# Altium schematic sheet Nest-Ditrib.SchDoc
size A3; SheetNumber: 1; SheetTotal: 1
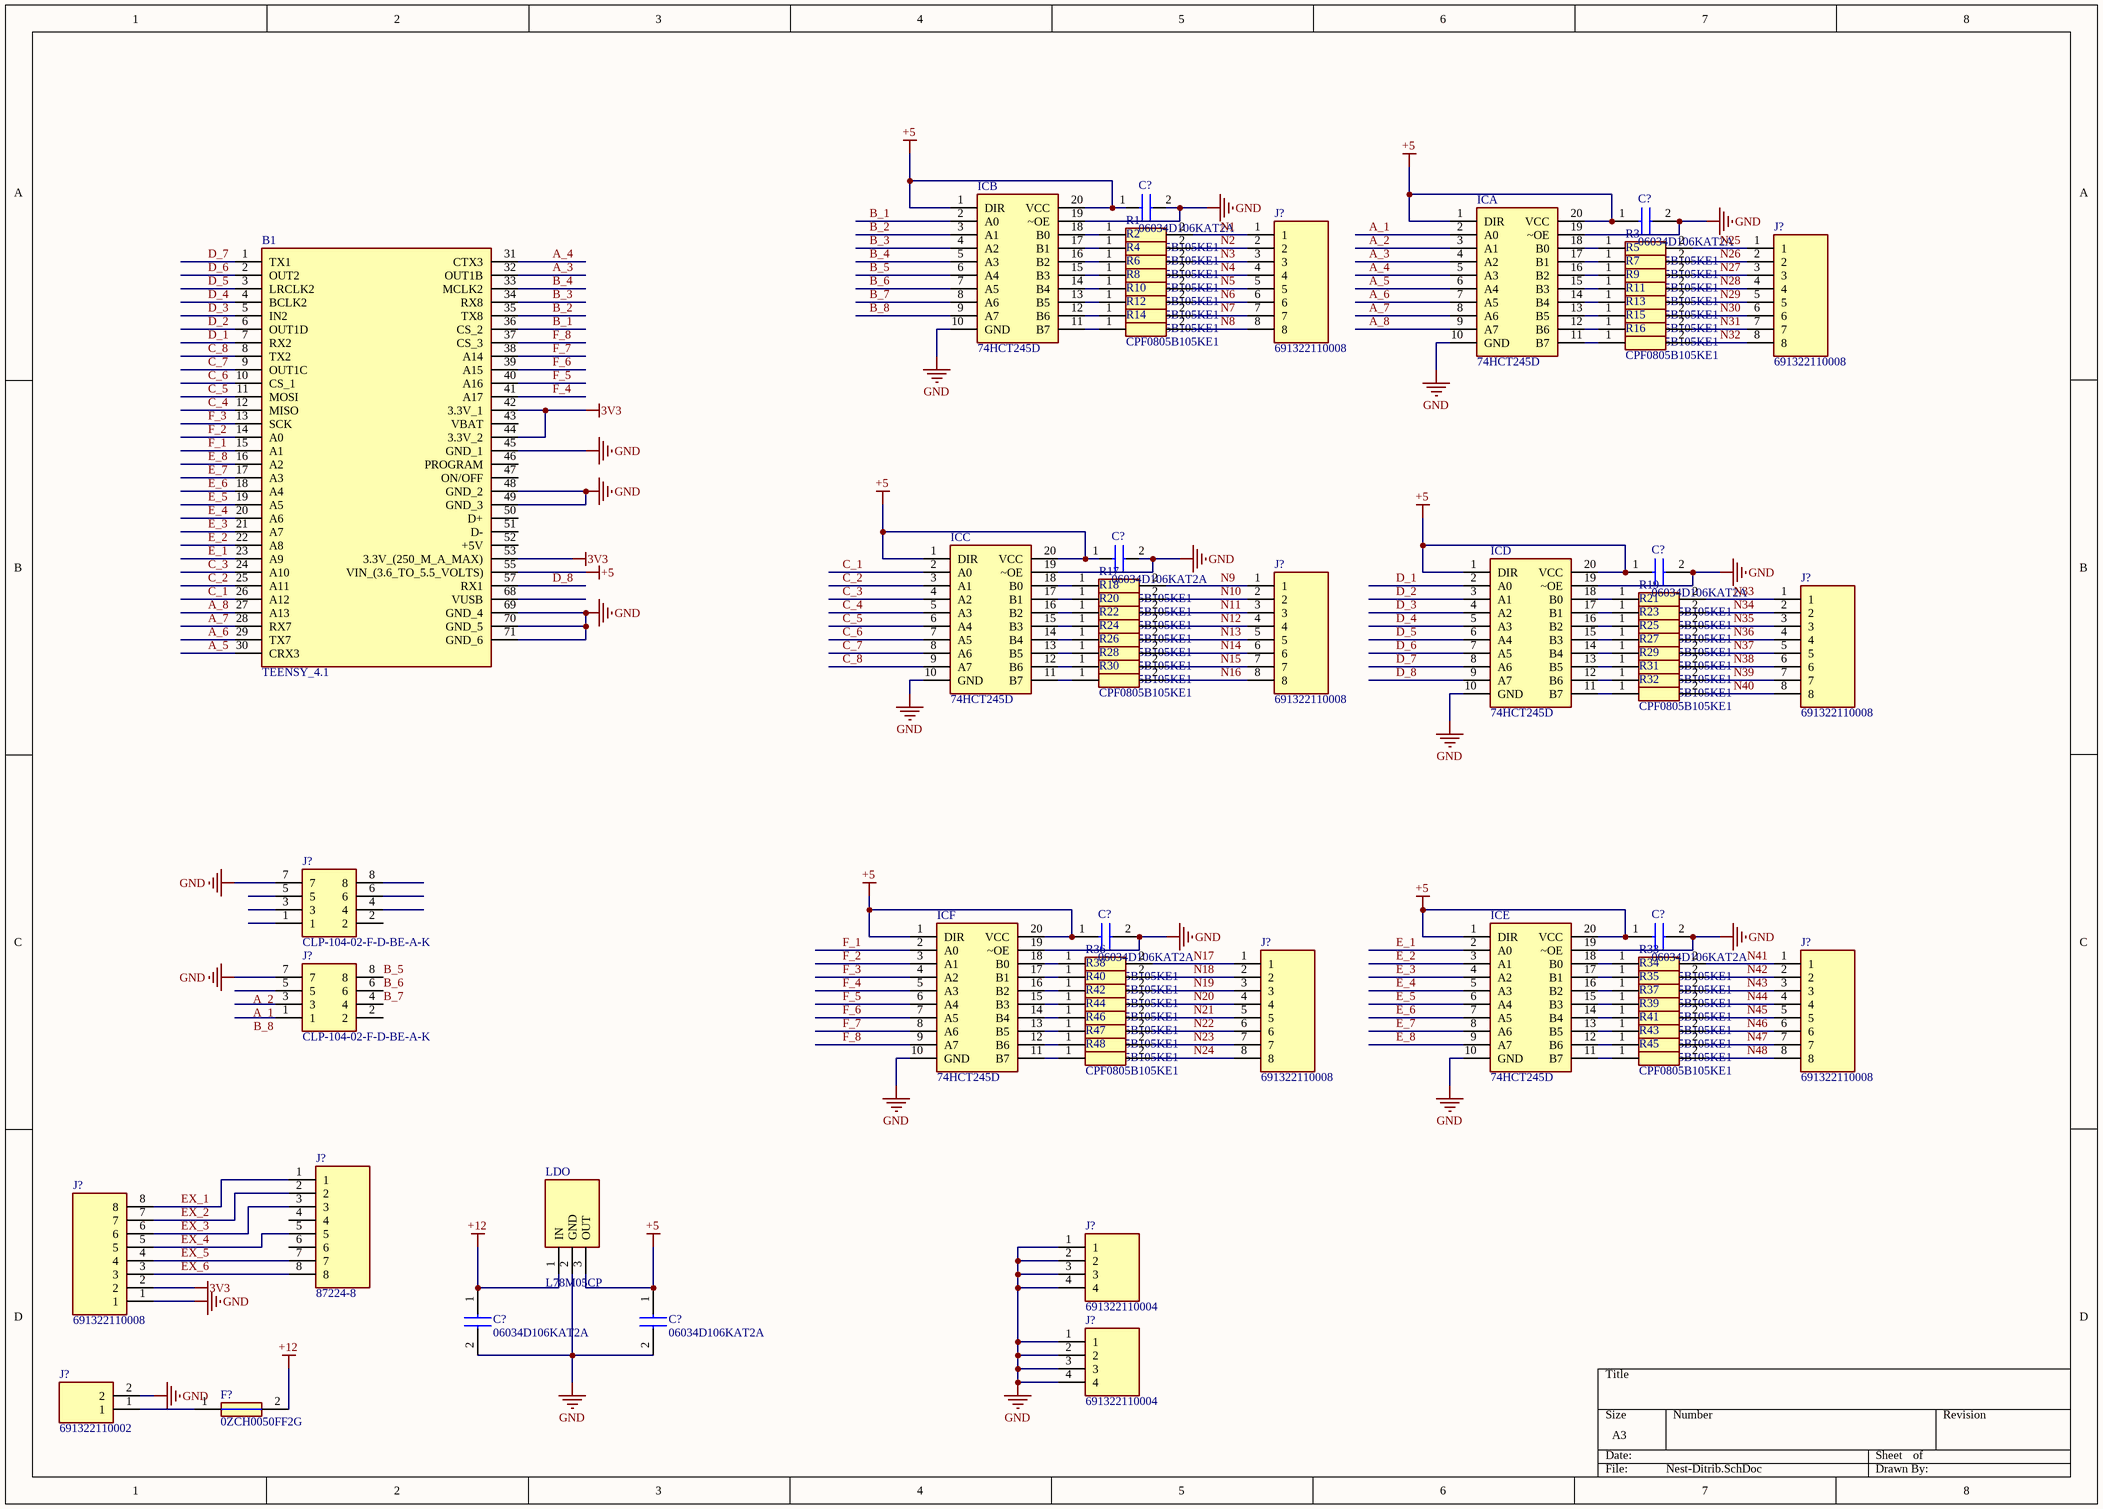
[diagram p0: Nest-Ditrib.SchDoc]

## Parts
(Parts that share a designator on the sheet are numbered #1, #2 ... from top to bottom, then left to right.)
B1  TEENSY_4.1  [TEENSY41]
C?#1  06034D106KAT2A  [CAPC1608X90N]
C?#2  06034D106KAT2A  [CAPC1608X90N]
C?#3  06034D106KAT2A  [CAPC1608X90N]
C?#4  06034D106KAT2A  [CAPC1608X90N]
C?#5  06034D106KAT2A  [CAPC1608X90N]
C?#6  06034D106KAT2A  [CAPC1608X90N]
C?#7  06034D106KAT2A  [CAPC1608X90N]
C?#8  06034D106KAT2A  [CAPC1608X90N]
F?  0ZCH0050FF2G  [FUSC3226X75N]
ICA  74HCT245D  [SOIC127P1032X265-20N]
ICB  74HCT245D  [SOIC127P1032X265-20N]
ICC  74HCT245D  [SOIC127P1032X265-20N]
ICD  74HCT245D  [SOIC127P1032X265-20N]
ICE  74HCT245D  [SOIC127P1032X265-20N]
ICF  74HCT245D  [SOIC127P1032X265-20N]
J?#1  691322110008  [SHDRRA8W80P0X350_1X8_2940X920X720P]
J?#2  691322110008  [SHDRRA8W80P0X350_1X8_2940X920X720P]
J?#3  691322110008  [SHDRRA8W80P0X350_1X8_2940X920X720P]
J?#4  691322110008  [SHDRRA8W80P0X350_1X8_2940X920X720P]
J?#5  CLP-104-02-F-D-BE-A-K  [CLP-104-02-XXX-D-BE-A-K]
J?#6  691322110008  [SHDRRA8W80P0X350_1X8_2940X920X720P]
J?#7  691322110008  [SHDRRA8W80P0X350_1X8_2940X920X720P]
J?#8  CLP-104-02-F-D-BE-A-K  [CLP-104-02-XXX-D-BE-A-K]
J?#9  87224-8  [HDRV8W77P0X254_1X8_1991X254X1037P]
J?#10  691322110004  [SHDRRA4W80P0X350_1X4_1540X920X700P]
J?#11  691322110008  [SHDRRA8W80P0X350_1X8_2940X920X720P]
J?#12  691322110004  [SHDRRA4W80P0X350_1X4_1540X920X700P]
J?#13  691322110002  [SHDRRA2W80P0X350_1X2_840X920X720P]
LDO  L78M05CP  [TO255P460X1020X2030-3P]
R1  CPF0805B105KE1  [RESC2012X65N]
R2  CPF0805B105KE1  [RESC2012X65N]
R3  CPF0805B105KE1  [RESC2012X65N]
R4  CPF0805B105KE1  [RESC2012X65N]
R5  CPF0805B105KE1  [RESC2012X65N]
R6  CPF0805B105KE1  [RESC2012X65N]
R7  CPF0805B105KE1  [RESC2012X65N]
R8  CPF0805B105KE1  [RESC2012X65N]
R9  CPF0805B105KE1  [RESC2012X65N]
R10  CPF0805B105KE1  [RESC2012X65N]
R11  CPF0805B105KE1  [RESC2012X65N]
R12  CPF0805B105KE1  [RESC2012X65N]
R13  CPF0805B105KE1  [RESC2012X65N]
R14  CPF0805B105KE1  [RESC2012X65N]
R15  CPF0805B105KE1  [RESC2012X65N]
R16  CPF0805B105KE1  [RESC2012X65N]
R17  CPF0805B105KE1  [RESC2012X65N]
R18  CPF0805B105KE1  [RESC2012X65N]
R19  CPF0805B105KE1  [RESC2012X65N]
R20  CPF0805B105KE1  [RESC2012X65N]
R21  CPF0805B105KE1  [RESC2012X65N]
R22  CPF0805B105KE1  [RESC2012X65N]
R23  CPF0805B105KE1  [RESC2012X65N]
R24  CPF0805B105KE1  [RESC2012X65N]
R25  CPF0805B105KE1  [RESC2012X65N]
R26  CPF0805B105KE1  [RESC2012X65N]
R27  CPF0805B105KE1  [RESC2012X65N]
R28  CPF0805B105KE1  [RESC2012X65N]
R29  CPF0805B105KE1  [RESC2012X65N]
R30  CPF0805B105KE1  [RESC2012X65N]
R31  CPF0805B105KE1  [RESC2012X65N]
R32  CPF0805B105KE1  [RESC2012X65N]
R33  CPF0805B105KE1  [RESC2012X65N]
R34  CPF0805B105KE1  [RESC2012X65N]
R35  CPF0805B105KE1  [RESC2012X65N]
R36  CPF0805B105KE1  [RESC2012X65N]
R37  CPF0805B105KE1  [RESC2012X65N]
R38  CPF0805B105KE1  [RESC2012X65N]
R39  CPF0805B105KE1  [RESC2012X65N]
R40  CPF0805B105KE1  [RESC2012X65N]
R41  CPF0805B105KE1  [RESC2012X65N]
R42  CPF0805B105KE1  [RESC2012X65N]
R43  CPF0805B105KE1  [RESC2012X65N]
R44  CPF0805B105KE1  [RESC2012X65N]
R45  CPF0805B105KE1  [RESC2012X65N]
R46  CPF0805B105KE1  [RESC2012X65N]
R47  CPF0805B105KE1  [RESC2012X65N]
R48  CPF0805B105KE1  [RESC2012X65N]

## Nets
3V3: B1.42(3.3V_1) B1.44(3.3V_2) B1.53(3.3V_(250_M_A_MAX)) J?#11.2
+5: B1.55(VIN_(3.6_TO_5.5_VOLTS)) C?#1.1 C?#2.1 C?#3.1 C?#4.1 C?#5.1 C?#6.1 C?#8.1 ICA.1(DIR) ICA.20(VCC) ICB.1(DIR) ICB.20(VCC) ICC.1(DIR) ICC.20(VCC) ICD.1(DIR) ICD.20(VCC) ICE.1(DIR) ICE.20(VCC) ICF.1(DIR) ICF.20(VCC) LDO.3(OUT)
+12: C?#7.1 F?.2 LDO.1(IN)
GND: B1.45(GND_1) B1.48(GND_2) B1.49(GND_3) B1.69(GND_4) B1.70(GND_5) B1.71(GND_6) C?#1.2 C?#2.2 C?#3.2 C?#4.2 C?#5.2 C?#6.2 C?#7.2 C?#8.2 ICA.10(GND) ICA.19(~OE) ICB.10(GND) ICB.19(~OE) ICC.10(GND) ICC.19(~OE) ICD.10(GND) ICD.19(~OE) ICE.10(GND) ICE.19(~OE) ICF.10(GND) ICF.19(~OE) J?#5.7 J?#8.7 J?#10.1 J?#10.2 J?#10.3 J?#10.4 J?#11.1 J?#12.1 J?#12.2 J?#12.3 J?#12.4 J?#13.2 LDO.2(GND)
A_1: ICA.2(A0) J?#8.3
A_2: ICA.3(A1) J?#8.5
A_3: B1.32(OUT1B) ICA.4(A2)
A_4: B1.31(CTX3) ICA.5(A3)
A_5: B1.30(CRX3) ICA.6(A4)
A_6: B1.29(TX7) ICA.7(A5)
A_7: B1.28(RX7) ICA.8(A6)
A_8: B1.27(A13) ICA.9(A7)
B_1: B1.36(CS_2) ICB.2(A0)
B_2: B1.35(TX8) ICB.3(A1)
B_3: B1.34(RX8) ICB.4(A2)
B_4: B1.33(MCLK2) ICB.5(A3)
B_5: ICB.6(A4) J?#8.8
B_6: ICB.7(A5) J?#8.6
B_7: ICB.8(A6) J?#8.4
B_8: ICB.9(A7) J?#8.1
C_1: B1.26(A12) ICC.2(A0)
C_2: B1.25(A11) ICC.3(A1)
C_3: B1.24(A10) ICC.4(A2)
C_4: B1.12(MISO) ICC.5(A3)
C_5: B1.11(MOSI) ICC.6(A4)
C_6: B1.10(CS_1) ICC.7(A5)
C_7: B1.9(OUT1C) ICC.8(A6)
C_8: B1.8(TX2) ICC.9(A7)
D_1: B1.7(RX2) ICD.2(A0)
D_2: B1.6(OUT1D) ICD.3(A1)
D_3: B1.5(IN2) ICD.4(A2)
D_4: B1.4(BCLK2) ICD.5(A3)
D_5: B1.3(LRCLK2) ICD.6(A4)
D_6: B1.2(OUT2) ICD.7(A5)
D_7: B1.1(TX1) ICD.8(A6)
D_8: B1.57(RX1) ICD.9(A7)
E_1: B1.23(A9) ICE.2(A0)
E_2: B1.22(A8) ICE.3(A1)
E_3: B1.21(A7) ICE.4(A2)
E_4: B1.20(A6) ICE.5(A3)
E_5: B1.19(A5) ICE.6(A4)
E_6: B1.18(A4) ICE.7(A5)
E_7: B1.17(A3) ICE.8(A6)
E_8: B1.16(A2) ICE.9(A7)
EX_1: J?#9.1 J?#11.8
EX_2: J?#9.2 J?#11.7
EX_3: J?#9.3 J?#11.6
EX_4: J?#9.5 J?#11.5
EX_5: J?#9.7 J?#11.4
EX_6: J?#9.8 J?#11.3
F_1: B1.15(A1) ICF.2(A0)
F_2: B1.14(A0) ICF.3(A1)
F_3: B1.13(SCK) ICF.4(A2)
F_4: B1.41(A17) ICF.5(A3)
F_5: B1.40(A16) ICF.6(A4)
F_6: B1.39(A15) ICF.7(A5)
F_7: B1.38(A14) ICF.8(A6)
F_8: B1.37(CS_3) ICF.9(A7)
N1: J?#1.1 R1.2
N2: J?#1.2 R2.2
N3: J?#1.3 R4.2
N4: J?#1.4 R6.2
N5: J?#1.5 R8.2
N6: J?#1.6 R10.2
N7: J?#1.7 R12.2
N8: J?#1.8 R14.2
N9: J?#3.1 R17.2
N10: J?#3.2 R18.2
N11: J?#3.3 R20.2
N12: J?#3.4 R22.2
N13: J?#3.5 R24.2
N14: J?#3.6 R26.2
N15: J?#3.7 R28.2
N16: J?#3.8 R30.2
N17: J?#6.1 R36.2
N18: J?#6.2 R38.2
N19: J?#6.3 R40.2
N20: J?#6.4 R42.2
N21: J?#6.5 R44.2
N22: J?#6.6 R46.2
N23: J?#6.7 R47.2
N24: J?#6.8 R48.2
N25: J?#2.1 R3.2
N26: J?#2.2 R5.2
N27: J?#2.3 R7.2
N28: J?#2.4 R9.2
N29: J?#2.5 R11.2
N30: J?#2.6 R13.2
N31: J?#2.7 R15.2
N32: J?#2.8 R16.2
N33: J?#4.1 R19.2
N34: J?#4.2 R21.2
N35: J?#4.3 R23.2
N36: J?#4.4 R25.2
N37: J?#4.5 R27.2
N38: J?#4.6 R29.2
N39: J?#4.7 R31.2
N40: J?#4.8 R32.2
N41: J?#7.1 R33.2
N42: J?#7.2 R34.2
N43: J?#7.3 R35.2
N44: J?#7.4 R37.2
N45: J?#7.5 R39.2
N46: J?#7.6 R41.2
N47: J?#7.7 R43.2
N48: J?#7.8 R45.2
NetF?_1: F?.1 J?#13.1
NetICA_11: ICA.11(B7) R16.1
NetICA_12: ICA.12(B6) R15.1
NetICA_13: ICA.13(B5) R13.1
NetICA_14: ICA.14(B4) R11.1
NetICA_15: ICA.15(B3) R9.1
NetICA_16: ICA.16(B2) R7.1
NetICA_17: ICA.17(B1) R5.1
NetICA_18: ICA.18(B0) R3.1
NetICB_11: ICB.11(B7) R14.1
NetICB_12: ICB.12(B6) R12.1
NetICB_13: ICB.13(B5) R10.1
NetICB_14: ICB.14(B4) R8.1
NetICB_15: ICB.15(B3) R6.1
NetICB_16: ICB.16(B2) R4.1
NetICB_17: ICB.17(B1) R2.1
NetICB_18: ICB.18(B0) R1.1
NetICC_11: ICC.11(B7) R30.1
NetICC_12: ICC.12(B6) R28.1
NetICC_13: ICC.13(B5) R26.1
NetICC_14: ICC.14(B4) R24.1
NetICC_15: ICC.15(B3) R22.1
NetICC_16: ICC.16(B2) R20.1
NetICC_17: ICC.17(B1) R18.1
NetICC_18: ICC.18(B0) R17.1
NetICD_11: ICD.11(B7) R32.1
NetICD_12: ICD.12(B6) R31.1
NetICD_13: ICD.13(B5) R29.1
NetICD_14: ICD.14(B4) R27.1
NetICD_15: ICD.15(B3) R25.1
NetICD_16: ICD.16(B2) R23.1
NetICD_17: ICD.17(B1) R21.1
NetICD_18: ICD.18(B0) R19.1
NetICE_11: ICE.11(B7) R45.1
NetICE_12: ICE.12(B6) R43.1
NetICE_13: ICE.13(B5) R41.1
NetICE_14: ICE.14(B4) R39.1
NetICE_15: ICE.15(B3) R37.1
NetICE_16: ICE.16(B2) R35.1
NetICE_17: ICE.17(B1) R34.1
NetICE_18: ICE.18(B0) R33.1
NetICF_11: ICF.11(B7) R48.1
NetICF_12: ICF.12(B6) R47.1
NetICF_13: ICF.13(B5) R46.1
NetICF_14: ICF.14(B4) R44.1
NetICF_15: ICF.15(B3) R42.1
NetICF_16: ICF.16(B2) R40.1
NetICF_17: ICF.17(B1) R38.1
NetICF_18: ICF.18(B0) R36.1

Not connected (* = marked no-connect by the designer): B1 43(VBAT) 46(PROGRAM) 47(ON/OFF) 50(D+) 51(D-) 52(+5V) 68(VUSB); J?#5 1 2 3 4 5 6 8; J?#8 2; J?#9 4 6

## Library data of the parts
B1 = TEENSY_4.1: Teensy 4.1 Development Board; Manufacturer_Name: PJRC; Manufacturer_Part_Number: TEENSY 4.1; Mouser Part Number: *; Mouser Price/Stock: *; Arrow Part Number: *; Arrow Price/Stock: *; Datasheet Link: https://www.pjrc.com/store/teensy41.html
C?#1-C?#8 = 06034D106KAT2A: Capacitor; Manufacturer_Name: AVX; Datasheet Link: https://componentsearchengine.com/Datasheets/1/06031A100FAT2A.pdf; Height: 0.9mm; Manufacturer_Part_Number: 06034D106KAT2A; Mouser Part Number: 581-06034D106K; Mouser Price/Stock: https://www.mouser.co.uk/ProductDetail/AVX/06034D106KAT2A/?qs=yeMJfaiNeLxq%252BdDt9K4ETA%3D%3D; Arrow Part Number: 06034D106KAT2A; Arrow Price/Stock: https://www.arrow.com/en/products/06034d106kat2a/avx
F? = 0ZCH0050FF2G: Fuse; Manufacturer_Name: BelFuse; Datasheet Link: https://componentsearchengine.com/Datasheets/1/0ZCH0050FF2G.pdf; Height: 0.75mm; Manufacturer_Part_Number: 0ZCH0050FF2G; Mouser Part Number: 530-0ZCH0050FF2G; Mouser Price/Stock: https://www.mouser.co.uk/ProductDetail/Bel-Fuse/0ZCH0050FF2G?qs=SRYZG9HaIQ2VrAxOxbTdxQ%3D%3D; Arrow Part Number: 0ZCH0050FF2G; Arrow Price/Stock: https://www.arrow.com/en/products/0zch0050ff2g/bel-group
ICA ICB ICC ICD ICE ICF = 74HCT245D: Integrated Circuit; Manufacturer_Name: Nexperia; Manufacturer_Part_Number: 74HCT245D; Mouser Part Number: N/A; Mouser Price/Stock: https://www.mouser.co.uk/ProductDetail/Nexperia/74HCT245D?qs=vHuUswq2%252Bswq%2FDWSRnGMaw%3D%3D
J?#1-J?#4 J?#6 J?#7 J?#11 = 691322110008: Connector; Manufacturer_Name: Wurth Elektronik; Datasheet Link: https://www.we-online.com/catalog/datasheet/691322110008.pdf; Height: 7.2mm; Manufacturer_Part_Number: 691322110008; Mouser Part Number: 710-691322110008; Mouser Price/Stock: https://www.mouser.co.uk/ProductDetail/Wurth-Elektronik/691322110008?qs=2kOmHSv6VfTkYbL8mFPSHA%3D%3D
J?#5 J?#8 = CLP-104-02-F-D-BE-A-K: Connector; Manufacturer_Name: SAMTEC; Datasheet Link: http://suddendocs.samtec.com/prints/erm8-xxx-xx.x-xxx-dv-xxxx-xx-mkt.pdf; Manufacturer_Part_Number: CLP-104-02-F-D-BE-A-K
J?#9 = 87224-8: Connector; Manufacturer_Name: TE Connectivity; Datasheet Link: https://www.te.com/commerce/DocumentDelivery/DDEController?Action=showdoc&DocId=Catalog+Section%7F1307819_SECTION_5%7F0908%7Fpdf%7FEnglish%7FENG_CS_1307819_SECTION_5_0908.pdf%7F87224-8; Height: 10.37mm; Manufacturer_Part_Number: 87224-8; Mouser Part Number: 571-872248; Mouser Price/Stock: https://www.mouser.co.uk/ProductDetail/TE-Connectivity/87224-8?qs=AplfTeSvkkCp9ZRzD7JZmw%3D%3D; Arrow Part Number: 87224-8; Arrow Price/Stock: https://www.arrow.com/en/products/87224-8/te-connectivity?region=nac
J?#10 J?#12 = 691322110004: Connector; Manufacturer_Name: Wurth Elektronik; Datasheet Link: http://katalog.we-online.de/em/datasheet/6913221100xx.pdf; Height: 7mm; Manufacturer_Part_Number: 691322110004; Mouser Part Number: 710-691322110004; Mouser Price/Stock: https://www.mouser.co.uk/ProductDetail/Wurth-Elektronik/691322110004?qs=7gQLVZk5cPn2UEoFVh2xVA%3D%3D
J?#13 = 691322110002: Connector; Manufacturer_Name: Wurth Elektronik; Datasheet Link: http://katalog.we-online.de/em/datasheet/6913221100xx.pdf; Height: 7.2mm; Manufacturer_Part_Number: 691322110002; Mouser Part Number: 710-691322110002; Mouser Price/Stock: https://www.mouser.co.uk/ProductDetail/Wurth-Elektronik/691322110002?qs=7gQLVZk5cPkDEmUnh1n5zw%3D%3D
LDO = L78M05CP: Integrated Circuit; Manufacturer_Name: STMicroelectronics; Datasheet Link: http://www.st.com/web/en/resource/technical/document/datasheet/CD00000447.pdf; Height: 4.6mm; Manufacturer_Part_Number: L78M05CP; Mouser Part Number: 511-L78M05CP; Mouser Price/Stock: https://www.mouser.co.uk/ProductDetail/STMicroelectronics/L78M05CP?qs=W%252B4obUA0F3anQylSbAkrfw%3D%3D; Arrow Part Number: L78M05CP; Arrow Price/Stock: https://www.arrow.com/en/products/l78m05cp/stmicroelectronics?region=europe
R1-R48 = CPF0805B105KE1: Resistor; Manufacturer_Name: TE Connectivity; Datasheet Link: http://docs-europe.electrocomponents.com/webdocs/13d1/0900766b813d116f.pdf; Height: 0.65mm; Manufacturer_Part_Number: CPF0805B105KE1; Mouser Part Number: 279-CPF0805B105KE1; Mouser Price/Stock: https://www.mouser.com/Search/Refine.aspx?Keyword=279-CPF0805B105KE1